# EasyEDA Pro project Temp_Con_V116.eprj, board PT_485
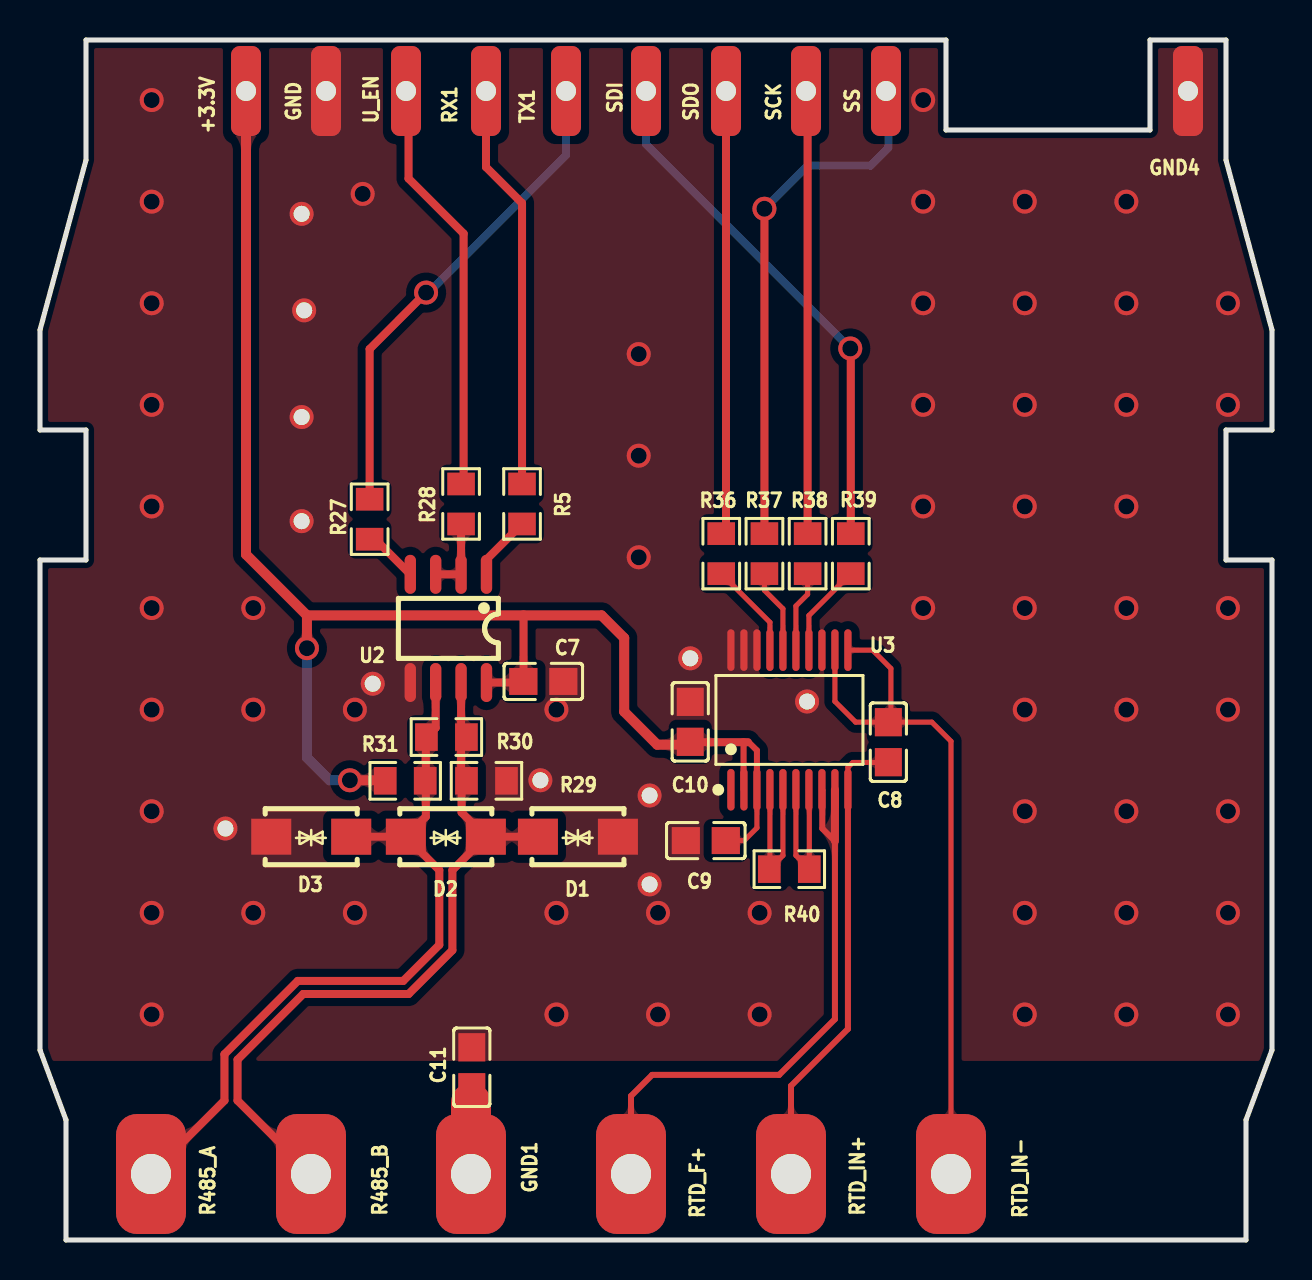
[diagram p8: board, top side]
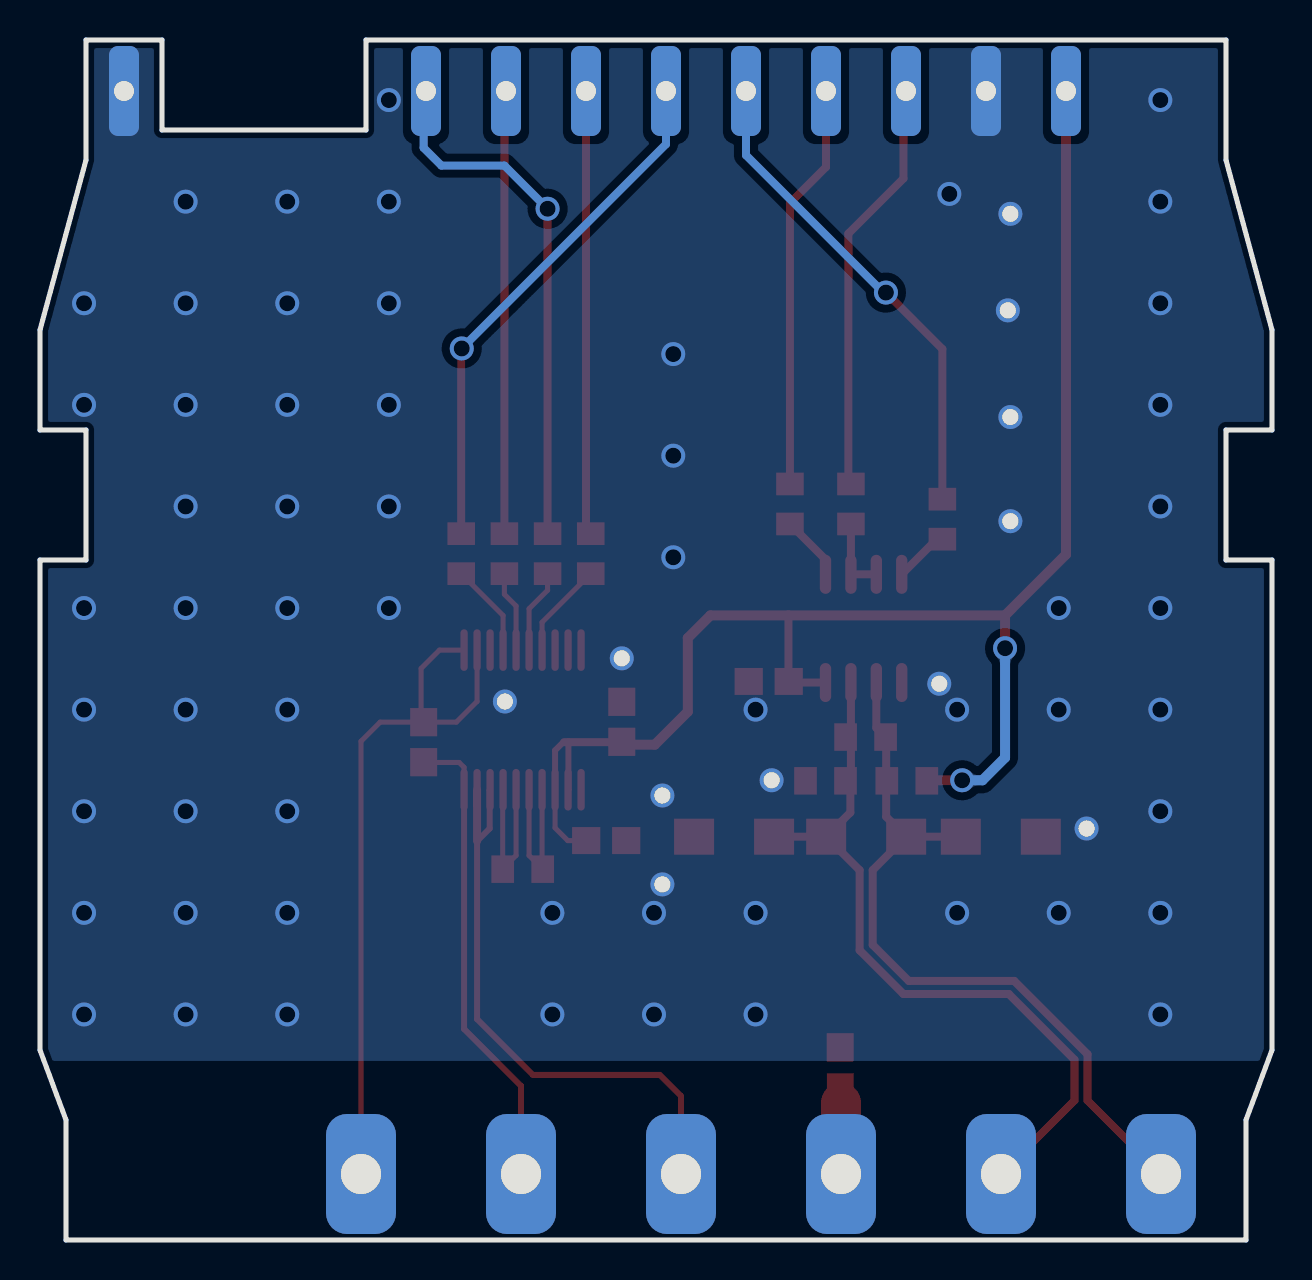
[diagram p9: board, bottom side, seen from below]

Outline 61.6 x 60 mm; copper layers: Top Layer, Bottom Layer. Coordinates in mm from the lower left corner of the outline.
Outline path: 0,45.5 0,40.5 2.3,40.5 2.3,34 0,34 0,9.5 1.3,6 1.3,0 60.3,0 60.3,6 61.6,9.5 61.6,34 59.3,34 59.3,40.5 61.6,40.5 61.6,45.5 59.3,54 59.3,60 55.5,60 55.5,55.5 45.3,55.5 45.3,60 2.3,60 2.3,54 0,45.5
Stack: Top Layer 0.035mm / Dielectric1 1.51mm FR4 er 4.5 / Bottom Layer 0.035mm

## Design rules (mm)
net R485_B: DP1
net R485_A: DP1
template: Custom Config
spacing copperThickness1oz (default): track to track 0.254, other pairs 0.203 to 0.305
spacing copperThickness2oz: track to track 0.203, other pairs 0.152 to 0.3
track width copperThickness1oz (default): min 0.127, default 0.254, max 2.54
track width copperThickness2oz: min 0.203, default 0.254, max 2.54
differential pair differentialPair (default): width min 0.254, default 0.4, max 2.54; gap min 0.254, default 0.254
via viaSize (default): diameter min 0.5, default 1.2, max 10; hole min 0.3, default 0.8, max 6.299

## Placement (name value [footprint] x y rotation side)
+3.3V  -  [S_FT]  10.3 57.45 0 top
C7  100nF  [C0805]  25.17 27.93 180 top
C8  100nF  [C0805]  42.42 24.89 90 top
C9  100nF  [C0805]  33.29 19.97 180 top
C10  100nF  [C0805]  32.51 25.91 90 top
C11  1nF  [C0805]  21.59 8.64 90 top
D1  SMAJ12CA  [SMA_L4.4-W2.6-LS5.0-BI]  26.9 20.17 0 top
D2  SMAJ12CA  [SMA_L4.4-W2.6-LS5.0-BI]  20.29 20.17 0 top
D3  SMAJ12CA  [SMA_L4.4-W2.6-LS5.0-BI]  13.56 20.17 0 top
GND  -  [S_FT]  14.3 57.45 0 top
GND1  -  [B_FT]  21.55 3.3 180 top
GND4  -  [S_FT]  57.4 57.45 180 top
NOREF  -  [Pad_e874]  13.21 46.48 0 top
NOREF#2  -  [Pad_e877]  13.08 51.31 0 top
NOREF#3  -  [Pad_e863]  9.27 20.57 0 top
NOREF#4  -  [Pad_e867]  30.48 17.78 0 top
NOREF#5  -  [Pad_e872]  16.64 27.81 0 top
NOREF#6  -  [Pad_e870]  32.51 29.08 0 top
NOREF#7  -  [Pad_e868]  30.48 22.22 0 top
NOREF#8  -  [Pad_e875]  13.08 41.15 0 top
NOREF#9  -  [Pad_e871]  38.35 26.92 0 top
NOREF#10  -  [Pad_e876]  13.08 35.94 0 top
NOREF#11  -  [Pad_e866]  25.02 22.99 0 top
R5  1kΩ  [R0805]  24.1 36.8 270 top
R27  1kΩ  [R0805]  16.48 36.04 270 top
R28  1kΩ  [R0805]  21.05 36.8 270 top
R29  4.7kΩ  [R0805]  22.32 22.96 0 top
R30  120Ω  [R0805]  20.32 25.15 0 top
R31  4.7kΩ  [R0805]  18.26 22.96 0 top
R36  0Ω  [R0805]  34.06 34.32 270 top
R37  0Ω  [R0805]  36.22 34.32 270 top
R38  0Ω  [R0805]  38.38 34.32 270 top
R39  0Ω  [R0805]  40.54 34.32 270 top
R40  400Ω  [R0805]  37.47 18.54 180 top
R485_A  -  [B_FT]  5.55 3.3 180 top
R485_B  -  [B_FT]  13.55 3.3 180 top
RTD_F+  -  [B_FT]  29.55 3.3 180 top
RTD_IN+  -  [B_FT]  37.55 3.3 180 top
RTD_IN-  -  [B_FT]  45.55 3.3 180 top
RX1  -  [S_FT]  22.3 57.45 180 top
SCK  -  [S_FT]  38.3 57.45 180 top
SDI  -  [S_FT]  30.3 57.45 180 top
SDO  -  [S_FT]  34.3 57.45 180 top
SS  -  [S_FT]  42.3 57.45 180 top
TX1  -  [S_FT]  26.3 57.45 180 top
U2  SP3485EN-L/TR  [SOIC-8_L5.0-W4.0-P1.27-LS6.0-BL]  20.42 30.58 180 top
U3  MAX31865AAP+T  [SSOP-20_L7.2-W5.3-P0.65-LS7.8-BL]  37.47 26 0 top
U_EN  -  [S_FT]  18.3 57.45 180 top

## Footprints (pads in the part's own frame, mm; a bottom-side part is the same pattern mirrored in y, then rotated)
B_FT
  rrect 3.5x6 hole 2x1.5: 1(0,0)
C0805
  rect 1.41x1.35 smd: 1(-1,0) 2(1,0)
Pad_e863
  round 1.2 hole 0.8: 1(0,0)
Pad_e866
  round 1.2 hole 0.8: 1(0,0)
Pad_e867
  round 1.2 hole 0.8: 1(0,0)
Pad_e868
  round 1.2 hole 0.8: 1(0,0)
Pad_e870
  round 1.2 hole 0.8: 1(0,0)
Pad_e871
  round 1.2 hole 0.8: 1(0,0)
Pad_e872
  round 1.2 hole 0.8: 1(0,0)
Pad_e874
  round 1.2 hole 0.8: 1(0,0)
Pad_e875
  round 1.2 hole 0.8: 1(0,0)
Pad_e876
  round 1.2 hole 0.8: 1(0,0)
Pad_e877
  round 1.2 hole 0.8: 1(0,0)
R0805
  rect 1.133x1.377 smd: 1(-1,0) 2(1,0)
S_FT
  rrect 1.5x4.5 hole 1: 1(0,0)
SMA_L4.4-W2.6-LS5.0-BI
  rect 2x1.8 smd: 1(-2,0) 2(2,0)
SOIC-8_L5.0-W4.0-P1.27-LS6.0-BL
  oval 0.569x1.95 smd: 1(-1.905,-2.705) 2(-0.635,-2.705) 3(0.635,-2.705) 4(1.905,-2.705) 5(1.905,2.705) 6(0.635,2.705) 7(-0.635,2.705) 8(-1.905,2.705)
SSOP-20_L7.2-W5.3-P0.65-LS7.8-BL
  oval 0.364x2.082 smd: 1(-2.925,-3.491) 2(-2.275,-3.491) 3(-1.625,-3.491) 4(-0.975,-3.491) 5(-0.325,-3.491) 6(0.325,-3.491) 7(0.975,-3.491) 8(1.625,-3.491) 9(2.275,-3.491) 10(2.925,-3.491) 11(2.925,3.491) 12(2.275,3.491) 13(1.625,3.491) 14(0.975,3.491) 15(0.325,3.491) 16(-0.325,3.491) 17(-0.975,3.491) 18(-1.625,3.491) 19(-2.275,3.491) 20(-2.925,3.491)

## Nets
As in the schematic, except:
GND: C7.1 C9.2 C10.2 C11.2 D1.2 D3.1 GND.1 GND4.1 NOREF.1 NOREF#2.1 NOREF#3.1 NOREF#4.1 NOREF#5.1 NOREF#6.1 NOREF#7.1 NOREF#8.1 NOREF#9.1 NOREF#10.1 NOREF#11.1 R29.2 U2.5 U3.13 U3.18 U3.19 U3.20

Pads without a net: U3 1

## Via types
v1: diameter 1.2, hole 0.8, Top Layer to Bottom Layer, 62 vias

## Routing (per net, layer and track width the routed paths; a pad name or vN(x,y) marks a point on that pad's centre or on a via; arc(x,y) is an arc through that point)
+3.3V: length 80.1
  Top Layer w0.254: C9.1 35.21,19.97 35.85,20.61 U3.3
  Top Layer w0.3: 35.42,24.91 35.85,24.48 U3.3 ; U3.2 35.18,22.53 35.18,24.91
  Top Layer w0.4: U2.8 24.11,27.87 C7.2 24.18,27.94 24.18,31.23 ; C10.1 32.77,24.91 32.79,24.89 35.4,24.89
  Top Layer w0.5: 32.77,24.91 32.62,24.77 30.86,24.77 29.21,26.42 29.21,30.1 28.08,31.23 13.35,31.23 ; v1(15.49,22.99) 17.23,22.99 R31.1 ; 13.35,31.23 v1(13.35,29.59) ; 13.35,31.23 10.3,34.28 +3.3V.1
  Bottom Layer w0.5: v1(13.35,29.59) 13.35,24.12 14.48,22.99 v1(15.49,22.99)
GND:
  vias: v1(5.58,57) v1(5.58,51.92) v1(5.58,46.84) v1(5.58,41.76) v1(5.58,36.68) v1(5.58,31.6) v1(5.58,26.52) v1(5.58,21.44) v1(5.58,16.36) v1(5.58,11.28) v1(10.66,31.6) v1(10.66,26.52) v1(10.66,16.36) v1(15.74,26.52) v1(15.74,16.36) v1(16.13,52.3) v1(25.82,26.52) v1(25.82,16.36) v1(25.82,11.28) v1(29.94,44.3) v1(29.94,39.22) v1(29.94,34.14) v1(30.9,16.36) v1(30.9,11.28) v1(35.98,16.36) v1(35.98,11.28) v1(44.16,57) v1(44.16,51.92) v1(44.16,46.84) v1(44.16,41.76) v1(44.16,36.68) v1(44.16,31.6) v1(49.24,51.92) v1(49.24,46.84) v1(49.24,41.76) v1(49.24,36.68) v1(49.24,31.6) v1(49.24,26.52) v1(49.24,21.44) v1(49.24,16.36) v1(49.24,11.28) v1(54.32,51.92) v1(54.32,46.84) v1(54.32,41.76) v1(54.32,36.68) v1(54.32,31.6) v1(54.32,26.52) v1(54.32,21.44) v1(54.32,16.36) v1(54.32,11.28) v1(59.4,46.84) v1(59.4,41.76) v1(59.4,31.6) v1(59.4,26.52) v1(59.4,21.44) v1(59.4,16.36) v1(59.4,11.28)
GND1: length 3.6
  Top Layer w2: GND1.1 21.55,6.86
R485_A: length 37.7
  Top Layer w0.4: U2.6 19.78,25.61 19.29,25.12 19.29,21.17 D2.1 ; D2.1 19.97,18.49 19.97,14.76 18.16,12.95 12.89,12.95 9.22,9.29 9.22,6.97 R485_A.1 ; D2.1 D3.2
R485_B: length 37.6
  Top Layer w0.4: R485_B.1 9.88,6.97 9.88,9.02 13.16,12.3 18.43,12.3 20.62,14.49 20.62,18.49 D2.2 ; D2.2 21.08,21.37 21.08,22.72 R29.1 21.05,23.23 U2.7 ; D2.2 D1.1
RTD_F+: length 30
  Top Layer w0.3: RTD_F+.1 29.55,7.2 30.61,8.25 36.96,8.25 39.75,11.04 39.75,19.94 39.12,20.57 39.12,22.49 U3.8
  Top Layer w0.4: 39.75,19.94 U3.9
RTD_F-: length 35.9
  Top Layer w0.254: 42.54,26.03 42.54,28.58 41.63,29.49 U3.11 ; RTD_IN-.1 45.55,24.94 44.59,25.89 C8.2 40.78,25.89 39.75,26.93 U3.12
RTD_IN+: length 23.6
  Top Layer w0.254: U3.10 40.4,23.63 40.64,23.88 42.4,23.88 C8.1
  Top Layer w0.3: U3.10 40.4,10.55 37.55,7.71 RTD_IN+.1
SCLK: length 22.2
  Top Layer w0.4: SCK.1 38.38,57.37 R38.1
SDI: length 26.4
  Top Layer w0.4: v1(40.51,44.58) 40.54,44.55 R39.1
  Bottom Layer w0.4: SDI.1 30.3,54.79 v1(40.51,44.58)
SDO: length 22.2
  Top Layer w0.4: R36.1 34.3,35.56 SDO.1
SS: length 26.6
  Top Layer w0.4: R37.1 v1(36.22,51.56)
  Bottom Layer w0.4: v1(36.22,51.56) 38.38,53.72 41.53,53.72 42.42,54.61 42.42,57.33 SS.1
U1_EN: length 20.9
  Top Layer w0.4: R28.1 21.18,37.93 21.18,50.32 18.43,53.07 18.43,57.32 U_EN.1
U1_RX: length 20.4
  Top Layer w0.4: R5.1 24.1,51.84 22.3,53.65 RX1.1
U1_TX: length 24.6
  Top Layer w0.4: R27.1 16.48,44.55 v1(19.3,47.37)
  Bottom Layer w0.4: v1(19.3,47.37) 19.43,47.37 26.3,54.24 TX1.1
$2N377: length 4.8
  Top Layer w0.254: R36.2 36.5,30.88 U3.17
$2N381: length 4.2
  Top Layer w0.254: U3.16 37.15,31.56 36.22,32.49 R37.2
$2N386: length 4.1
  Top Layer w0.254: R38.2 38.38,32.28 37.8,31.7 U3.15
$2N391: length 4.7
  Top Layer w0.254: U3.14 38.45,31.22 R39.2
$2N592: length 8.2
  Top Layer w0.254: 36.5,18.57 37.15,19.22 U3.5 ; 36.5,18.57 U3.4 ; 36.5,18.57 R40.2
$2N609: length 8.2
  Top Layer w0.254: U3.7 38.47,22.49 38.47,18.56 37.8,19.23 U3.6
$3N638: length 3.3
  Top Layer w0.4: R5.2 22.32,34.02 U2.1
$3N639: length 3.8
  Top Layer w0.4: R28.2 U2.2 U2.3
$3N640: length 2.8
  Top Layer w0.4: R27.2 16.76,35.04 U2.4

## Copper pours and planes (outline as drawn; the poured copper is in the pictures)
GND on Top Layer: 0,40.5 2.3,40.5 2.3,34 0,34 0,8.95 61.6,8.95 61.6,34 59.3,34 59.3,40.5 61.6,40.5 61.6,45.5 59.3,54 59.3,60 55.5,60 55.5,55.5 45.3,55.5 45.3,60 2.3,60 2.3,54 0,45.5
GND on Bottom Layer: 0,40.5 2.3,40.5 2.3,34 0,34 0,8.95 61.6,8.95 61.6,34 59.3,34 59.3,40.5 61.6,40.5 61.6,45.5 59.3,54 59.3,60 55.5,60 55.5,55.5 45.3,55.5 45.3,60 2.3,60 2.3,54 0,45.5

Small or netless copper shapes (teardrops, artwork), in the pictures only: 65 on Top Layer, 2 on Bottom Layer
